# Altium schematic sheet Power.SchDoc: Power
size A4; DocumentNumber: MB1246; Revision: B.1; SheetNumber: 3; SheetTotal: 17; Project: STM32H7xxI-EVAL
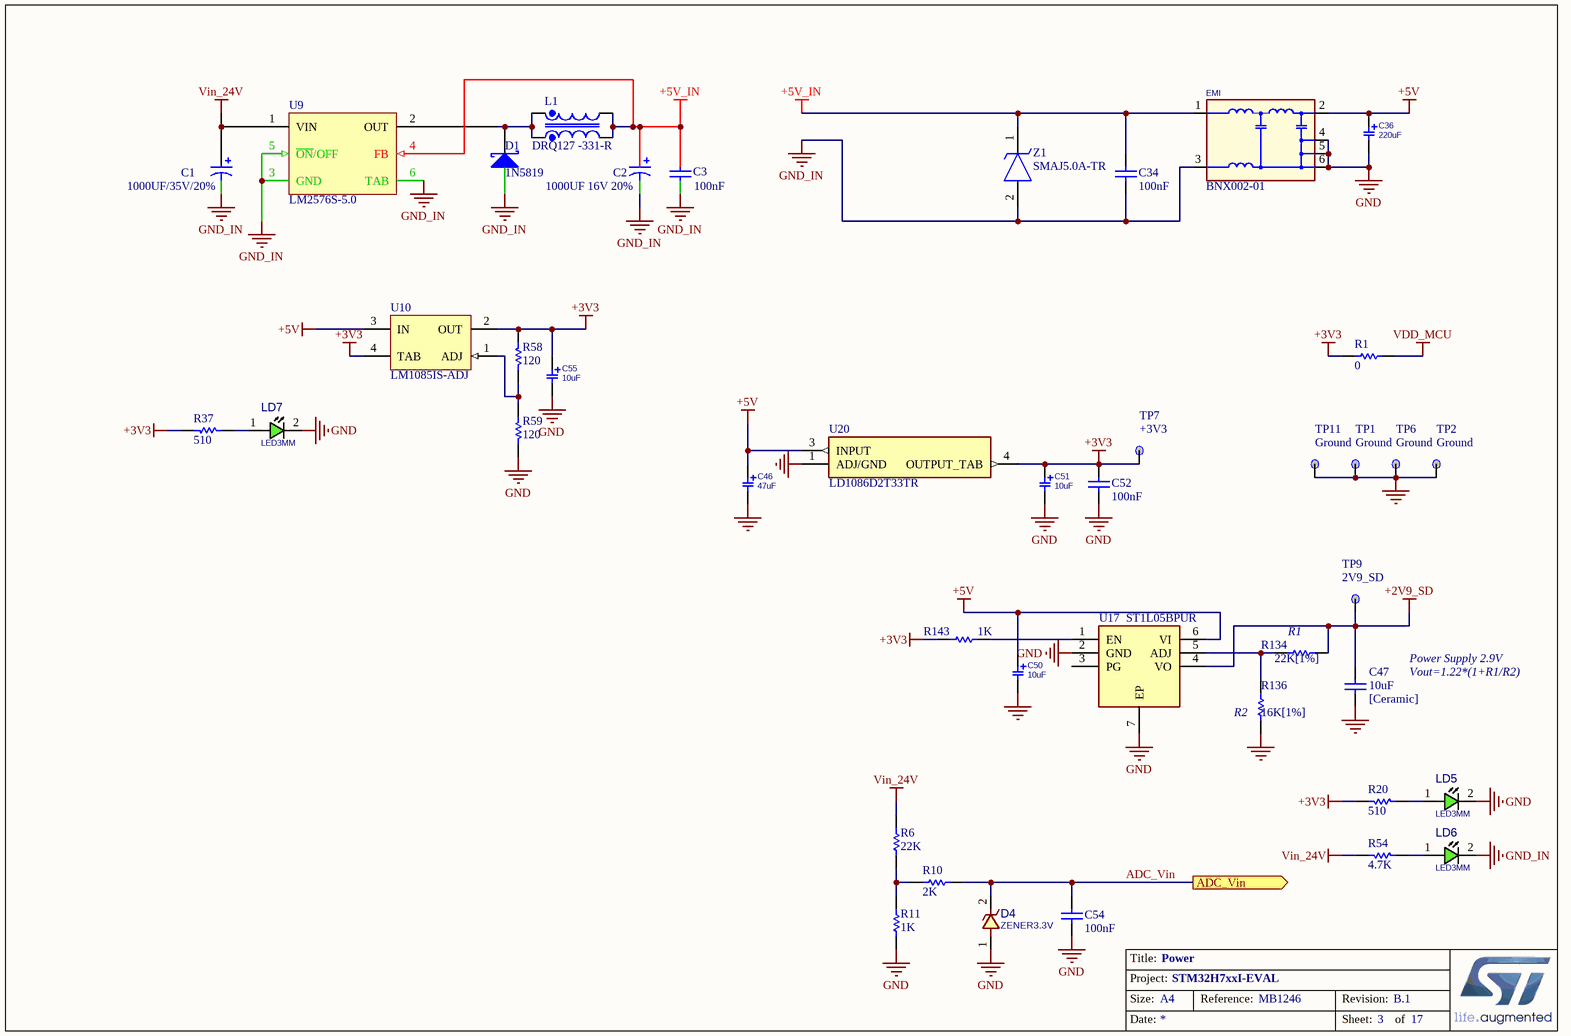
[diagram p0: Power.SchDoc]

## Parts
C1  1000UF/35V/20%  [RB.2/.4]
C2  1000UF 16V 20%  [RB.2/.4]
C3  100nF  [C0603E]
C34  100nF  [C0603E]
C36  220uF  [C_TN_7343]
C46  47uF  [C_TN_3528]
C47  10uF  [C0603E]
C50  10uF  [C_TN_3216]
C51  10uF  [C_TN_3216]
C52  100nF  [C0603E]
C54  100nF  [C0603E]
C55  10uF  [C_TN_3528]
D1  1N5819  [DO-41]
D4  ZENER3.3V  [D_SOD523]
EMI  BNX002-01  [BNX002]
L1  DRQ127 -331-R  [Inductor DRQ127Series]
LD5  LED3MM  [LED3MM]
LD6  LED3MM  [LED3MM]
LD7  LED3MM  [LED3MM]
R1  0  [R1206E]
R6  22K  [R0603E]
R10  2K  [R0603E]
R11  1K  [R0603E]
R20  510  [R0603E]
R37  510  [R0603E]
R54  4.7K  [R0603E]
R58  120  [R0603E]
R59  120  [R0603E]
R134  22K[1%]  [R0603E]
R136  16K[1%]  [R0603E]
R143  1K  [R0603E]
TP1  Ground  [TP]
TP2  Ground  [TP]
TP6  Ground  [TP]
TP7  +3V3  [TP]
TP9  2V9_SD  [TP]
TP11  Ground  [TP]
U9  LM2576S-5.0  [TO-263-5]
U10  LM1085IS-ADJ  [TS3B_N]
U17  ST1L05BPUR  [SON95P300X300X100-7N-D]
U20  LD1086D2T33TR  [TO254P1542X460-3N]
Z1  SMAJ5.0A-TR  [SM4T82AY]

## Ports
ADC_Vin (out)

## Nets
+2V9_SD: C47.1 R134.1 TP9.1 U17.4(VO)
+3V3: C51.1 C52.1 C55.1 R1.2 R20.1 R37.1 R58.1 R143.2 TP7.1 U10.2(OUT) U10.4(TAB) U20.4(OUTPUT_TAB)
+5V: C36.1 C46.1 C50.1 EMI.2(CB) U10.3(IN) U17.6(VI) U20.3(INPUT)
+5V_IN: C2.1 C3.2 C34.1 EMI.1(B) L1.3 L1.4 U9.4(FB) Z1.1(K)
GND: C36.2 C46.2 C47.2 C50.2 C51.2 C52.2 C54.2 C55.2 D4.1 EMI.4(CG1) EMI.5(CG2) EMI.6(CG3) LD5.2(CATHODE) LD7.2(CATHODE) R11.2 R59.2 R136.2 TP1.1 TP2.1 TP6.1 TP11.1 U17.2(GND) U17.7(EP) U20.1(ADJ/GND)
GND_IN: C1.2 C2.2 C3.1 C34.2 D1.1(A) EMI.3(PSG) LD6.2(CATHODE) U9.3(GND) U9.5(~{ON}/OFF) U9.6(TAB) Z1.2(A)
VDD_MCU: R1.1
Vin_24V: C1.1 R6.1 R54.1 U9.1(VIN)
ADC_Vin: C54.1 D4.2 R10.2 ; port ADC_Vin
NetD1_2: D1.2(K) L1.1 L1.2 U9.2(OUT)
NetLD5_1: LD5.1(ANODE) R20.2
NetLD6_1: LD6.1(ANODE) R54.2
NetLD7_1: LD7.1(ANODE) R37.2
NetR6_2: R6.2 R10.1 R11.1
NetR58_2: R58.2 R59.1 U10.1(ADJ)
NetR134_2: R134.2 R136.1 U17.5(ADJ)
NetR143_1: R143.1 U17.1(EN)

Not connected (* = marked no-connect by the designer): U17 3(PG)

## Notes on the sheet
- (near R134) R1
- (near R136) R2
- (near C47) [Ceramic]
- Power Supply 2.9V
- Vout=1.22*(1+R1/R2)
- Title:
- Project:
- Size:
- Date:
- A4
- Reference:
- Sheet:
- Revision:
- of

## Library data of the parts
C1 = Cap Pol1: Polarized Aluminum Electrolytic Capacitor (Radial) , Lead Spacing :5.00mm  Diameter : 10.00mm   Height - Seated (Max) : 21.50mm; Manufacturer: Rubycon; Assembly Status: A; Published: 8-Jun-2000; LatestRevisionDate: 17-Jul-2002; LatestRevisionNote: Re-released for DXP Platform.; PackageReference: RB7.6-15; Publisher: Altium Limited; Value: 1000UF/35V/20%; Current Footprint: RB.2/.4
C2 = Cap Pol1: Polarized Aluminum Electrolytic Capacitor (Radial) , Lead Spacing :5.00mm  Diameter : 10.00mm   Height - Seated (Max) : 16mm; Assembly Status: A; Published: 8-Jun-2000; LatestRevisionDate: 17-Jul-2002; LatestRevisionNote: Re-released for DXP Platform.; PackageReference: RB7.6-15; Publisher: Altium Limited; Value: 1000UF 16V 20%; Manufacturer: *; Current Footprint: RB.2/.4
C3 = Cap: Ceramic Capacitor; Manufacturer: Vishay or Panasonic; Current Footprint: 0805 (2012 Metric); Assembly Status: A; Published: 8-Jun-2000; LatestRevisionDate: 17-Jul-2002; LatestRevisionNote: Re-released for DXP Platform.; PackageReference: RAD-0.3; Publisher: Altium Limited; Value: 100nF
C34 = CAP: Capacitor; Value: 100pF; Published: 8-Jun-2000; Revision: July-2002: Re-released for DXP Platform.; Publisher: Altium Limited
C36 = CAP_SMD_TAN_220uF: CAP, SMD, TAN; PARAM: 20%, 35mOhm, -55~105oC; MANF: VISHAY; MANF_P#: T55D227M6R3C0035; PARAM2: 6.3V; PRICE: 1.9$; VALUE: 220uF
C46 C55 = CAP_SMD_TAN_10uF_16V: CAP, SMD, TAN; PARAM: 20%, 200mOhm, -55~105oC; MANF: AVX; MANF_P#: TCJT106M016R0200; PARAM2: 16V; PRICE: 1$
  C46: VALUE: 47uF
  C55: VALUE: 10uF
C47 C52 C54 = Cap: Capacitor; Value: 10nF; Published: 8-Jun-2000; Revision: July-2002: Re-released for DXP Platform.; Publisher: Altium Limited
C50 C51 = CAP_SMD_TAN_10uF_6.3V: CAP, SMD, TAN; PARAM: 20%, 300mOhm, -55~105oC; MANF: VISHAY; MANF_P#: T55A106M6R3C0300; PARAM2: 6.3V; PRICE: 0.46$; VALUE: 10uF
D1 = D Schottky: DIODE SCHOTTKY 40V 1A DO41; Manufacturer: Fairchild Semiconductor; Assembly Status: A; Published: 8-Jun-2000; LatestRevisionDate: 17-Jul-2002; LatestRevisionNote: Re-released for DXP Platform.; PackageReference: SMB; Publisher: Altium Limited; Code_JEDEC: DO-214-AA; Current Footprint: DO-41
D4 = DIODE_SMD_ZENER_MM5Z12V: DIODE, ZENER, 0.2W, 3.3V; MANF: Fairchild; DESC: DESCRIPTION; PARAM: 12V; ASSEMBLY: ASSEMBLY; PRICE: PRICE; PARAM2: 0.2W; MANF_P#: MM5Z12V; VALUE: ZENER3.3V
EMI = BNX002-01: EMIFIL, BLOCK TYPE,; MANF: MURATA; MANF_P#: BNX002-01; VALUE: BNX002-01
L1 = DRQ127 -331-R: Manufacturer: Eaton Bussmann; Part Picture: E:\Projects\Electrinic Part Pictures\DRQ127-331-R.bmp; PCB Project: FL3 Controller; Assembly Status: A; Board Qty: 300; Current Footprint: TO-263; Description1: INDUCT ARRAY 2 COIL 323.6UH SMD; in stock Qty: 0; Repository Qty: 55; Manufacturer Part Number: DRQ127-331-R; Mounting Type: Surface Mount; Package / Case: Nonstandard; Size / Dimension: 0.492" L x 0.492" W (12.50mm x 12.50mm); ComponentLink1URL: E:\DataSheet1\Coil\DRQ127-331-R.pdf; ComponentLink1Description: Datasheet; HelpURL: E:\DataSheet1\Coil\DRQ127-331-R.pdf; Main Supplier: Ocean Electronic (Int'L) Limited--(http://www.iic-ic.com); PackageDescription: Nonstandard; Part Number: DRQ127-331-R; Pricing: 350=1.35, 700=1.275, 1050=1.1625, 3500=1.125, 8750=1.0875, 17500=1.05, 35000=0.9975 (USD); SHOP NAME: ?; Supplier: Digi-Key; Supplier Device Package: Nonstandard; Supplier Part Number: 513-1317-2-ND
LD5-LD7 = LED_THD_3MM: LED, THD, 3MM, GREEN; DESC: DESCRIPTION; MANF_P#: MANF_PART#; PARAM2: 2.2V; MANF: MANF; ASSEMBLY: ASSEMBLY; PRICE: PRICE; VALUE: LED3MM
R1 R6 R10 = res1: Resistor; Value: 1K; Published: 8-Jun-2000; Revision: July-2002: Re-released for DXP Platform.; Publisher: Altium Limited
R11 R143 = res1: Resistor; Published: 8-Jun-2000; Revision: July-2002: Re-released for DXP Platform.; Publisher: Altium Limited; Value: 1K
R20 R37 R54 R58 R59 = Res1: Resistor: thick film; SMD; Manufacturer: Vishay or Panasonic; Manufacturer Part Number: NULL; Board Qty: 1000; Current Footprint: 0603 (1608 Metric); Value: 4.7KR; PCB Name: GS-101; ITEM/NO: 15; ComponentLink1Description: Datasheet; ComponentLink1URL: D:\HNA\Datasheet Documents\Resistor-Chip-UniOhm.pdf; Description1: Resistor: thick film; SMD; HelpURL: D:\HNA\Datasheet Documents\Resistor-Chip-UniOhm.pdf; Mounting Type: Surface Mount, MLCC; Package / Case: 0603 (1608 Metric); Pricing: NULL; Supplier: NULL; Supplier Part Number: NULL; Size / Dimension: NULL
  R20 R37: Part Number: 510
  R54: Part Number: 4.7K
  R58 R59: Part Number: 120
R134 R136 = Res1: Resistor; Value: 1K; Published: 8-Jun-2000; Revision: July-2002: Re-released for DXP Platform.; Publisher: Altium Limited
TP1 TP2 TP6 TP7 TP9 TP11 = TP
U9 = LM2575S-5.0: SIMPLE SWITCHER® 1A Step-Down Voltage Regulator, 5-pin TO-263; Manufacturer: National Semiconductor; Manufacturer: SEMTECH; PackageTopMarking: NSUZXYTTE#*LM2575S*-5.0 P+; PowerWise: N; Assembly Status: A; Published: 4-Dec-2008; DatasheetVersion: Apr-2007; PackageVersion: revD, Apr-2005; PackageReference: TS5B; Publisher: Altium Limited; PackageDescription: TO-263, Molded, .400 x .390 x .180in, 5 Lead, .067in Pitch, Surface Mount; Supplier 1: Farnell; Supplier Part Number 1: 1523849; Supplier 2: Farnell; Supplier Part Number 2: 9489860; PartNumber: LM2575S-5.0; RoHS: N; PinCount: 5; CompType: Switcher; Code_JEDEC: MO-169-AB; ComponentLink1Description: LM2575 Datasheet; ComponentLink1URL: http://www.national.com/ds/LM/LM2575.pdf; ComponentLink2Description: LM2575 Web Page; ComponentLink2URL: http://www.national.com/pf/LM/LM2575.html; ComponentLink3Description: TS5B Package Page; ComponentLink3URL: http://www.national.com/packaging/folders/ts5b.html; Current Footprint: TO-263-5; Price: 0.23$
U10 = LM1085IS-ADJ: 3A Low Dropout Positive Regulators, 3-pin TO-263; Manufacturer: National Semiconductor; PackageTopMarking: NSUZXYTTE#*LM1085*IS-ADJ; PowerWise: N; CompType: LDO IC; High-Reliability: Y; DatasheetVersion: Jun-2005; PackageVersion: revF, Apr-2005; PackageReference: TS3B; PackageDescription: TO-263, Molded, .400 x .390 x .180in, 3 Lead, .1in Pitch, Surface Mount; PartNumber: LM1085IS-ADJ; RoHS: N; PinCount: 3; Code_JEDEC: MO-169-AA; ComponentLink1Description: Manufacturer URL; ComponentLink1URL: http://www.national.com/; ComponentLink2Description: LM1085 Datasheet; ComponentLink2URL: http://www.national.com/ds/LM/LM1085.pdf; ComponentLink3Description: LM1085 Web Page; ComponentLink3URL: http://www.national.com/pf/LM/LM1085.html; ComponentLink4Description: TS3B Package Page; ComponentLink4URL: http://www.national.com/packaging/folders/ts3b.html
U17 = ST1L05BPUR: Integrated Circuit; Manufacturer_Name: STMicroelectronics; Datasheet Link: https://www.st.com/resource/en/datasheet/st1l05.pdf; Height: 1mm; Manufacturer_Part_Number: ST1L05BPUR; Mouser Part Number: 511-ST1L05BPUR; Mouser Price/Stock: https://www.mouser.co.uk/ProductDetail/STMicroelectronics/ST1L05BPUR?qs=MJw%2F449BOx8r6LrCfzDi%2FA%3D%3D; Arrow Part Number: ST1L05BPUR; Arrow Price/Stock: https://www.arrow.com/en/products/st1l05bpur/stmicroelectronics
U20 = LD1086D2T33TR: Integrated Circuit; Manufacturer_Name: STMicroelectronics; Datasheet Link: http://www.st.com/web/en/resource/technical/document/datasheet/CD00001884.pdf; Height: 4.6mm; Manufacturer_Part_Number: LD1086D2T33TR; Mouser Part Number: 511-LD1086D2T33-TR; Mouser Price/Stock: https://www.mouser.co.uk/ProductDetail/STMicroelectronics/LD1086D2T33TR?qs=NVtqiPcHxP%2FqlwvBP9ORAw%3D%3D; Arrow Part Number: LD1086D2T33TR; Arrow Price/Stock: https://www.arrow.com/en/products/ld1086d2t33tr/stmicroelectronics?region=europe
Z1 = SMAJ5.0A-TR: TVS Diode (Uni-directional); Manufacturer_Name: STMicroelectronics; Datasheet Link: https://www.st.com/resource/en/datasheet/smaj10ca.pdf; Height: 2.65mm; Manufacturer_Part_Number: SMAJ5.0A-TR; Mouser Part Number: 511-SMAJ5.0A; Mouser Price/Stock: https://www.mouser.co.uk/ProductDetail/STMicroelectronics/SMAJ5.0A-TR?qs=yuSVFimk%2FuaGVxy2BbsCxA%3D%3D; Arrow Part Number: SMAJ5.0A-TR; Arrow Price/Stock: https://www.arrow.com/en/products/smaj5.0a-tr/stmicroelectronics?region=nac